# Altium schematic sheet I2C Serial ID.SchDoc: Serial ID
size 292 x 193 mm; SheetNumber: 10; SheetTotal: 40
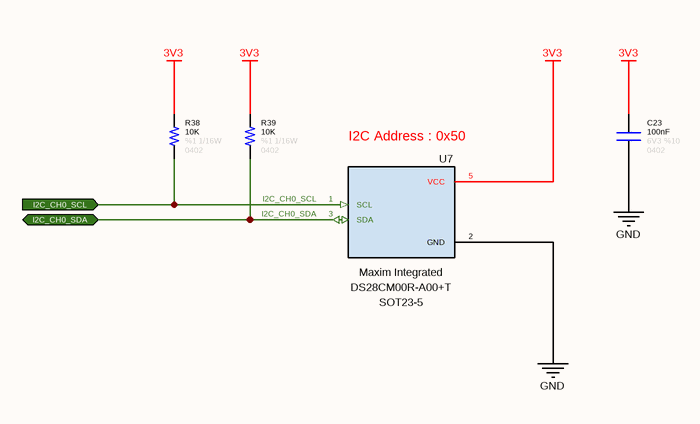
[diagram p0: I2C Serial ID.SchDoc]

## Parts
C23  value 100nF  Tolerance: %10  Voltage: 6V3  Case: 0402  [CAPACITOR_0402]  (hidden comment: Capacitor - 100nF [0402] (Ceramic))
R38  value 10K  Tolerance: %1  Case: 0402  Power: 1/16W  [RESISTOR_0402]  (hidden comment: 10K - 0402 - %1 - 1/16W)
R39  value 10K  Tolerance: %1  Case: 0402  Power: 1/16W  [RESISTOR_0402]  (hidden comment: 10K - 0402 - %1 - 1/16W)
U7  Manufacturer Name: Maxim Integrated  Case: SOT23-5  [SOT-23-5]  (hidden comment: DS28CM00R-A00+T)

## Ports
I2C_CH0_SCL (in), I2C_CH0_SDA (bidir)

## Nets
3V3: C23.2 R38.2 R39.2 U7.5(VCC)
GND: C23.1 U7.2(GND)
I2C_CH0_SCL: R38.1 U7.1(SCL) ; port I2C_CH0_SCL
I2C_CH0_SDA: R39.1 U7.3(SDA) ; port I2C_CH0_SDA

Not connected (* = marked no-connect by the designer): U7 4(NC)

## Notes on the sheet
- (near U7) I2C Address : 0x50
- © 2021 All rights reserved.
  This document may not, in whole or in part, be copied, photocopied, reproduced, translated or converted to any electronic or machine readable from without prior written permission of Mehmet Günce Akkoyun.
  Engineer contact : akkoyun@me.com
- Property of
- Engineer :
- Date :
- Size :
- A4
- Time :
- Project :
- Page :
- /
- Customer :
- Product ID :
- Module ID :
- Version :
- File :
- Revision :

## Library data of the parts
C23 = Capacitor - 100nF [0402-6V3]: Capacitor - 100nF [0402-6V3] (Ceramic); Manufacturer Name: AVX; Manufacturer Part Number: 04026D104KAT4A; ComponentLink1Description: Mouser; ComponentLink1URL: https://www.mouser.com.tr/ProductDetail/AVX/04026D104KAT4A?qs=sGAEpiMZZMs0AnBnWHyRQPg4iYkCw7IMED%2F4kpqgf7w%3D; ComponentLink2Description: DataSheet; ComponentLink2URL: https://www.mouser.com.tr/datasheet/2/40/cx5r-776519.pdf
R38 R39 = Resistor - 10K [0402]: Thick Film Resistors - SMD 1/16 W 10 KOhm 1%; Manufacturer Name: Vishay; Manufacturer Part Number: CRCW040210K0FKED; ComponentLink1Description: DataSheet; ComponentLink1URL: https://www.mouser.com.tr/datasheet/2/427/dcrcwe3-1762152.pdf; ComponentLink2Description: Mouser; ComponentLink2URL: https://www.mouser.com.tr/ProductDetail/Vishay-Dale/CRCW040210K0FKED?qs=sGAEpiMZZMu61qfTUdNhG2DpbjADlD3GcalbOv9utCY%3D
U7 = IC - DS28C: Security ICs / Authentication ICs I C/SMBus Silicon Serial Number; Data Bus Width: 64 bit; RoHS: Yes; Product Type: Security ICs; Manufacturer Part Number: DS28CM00R-A00+T